# Altium schematic sheet 8KNOBS.SchDoc
size A4; SheetNumber: 3; SheetTotal: 5
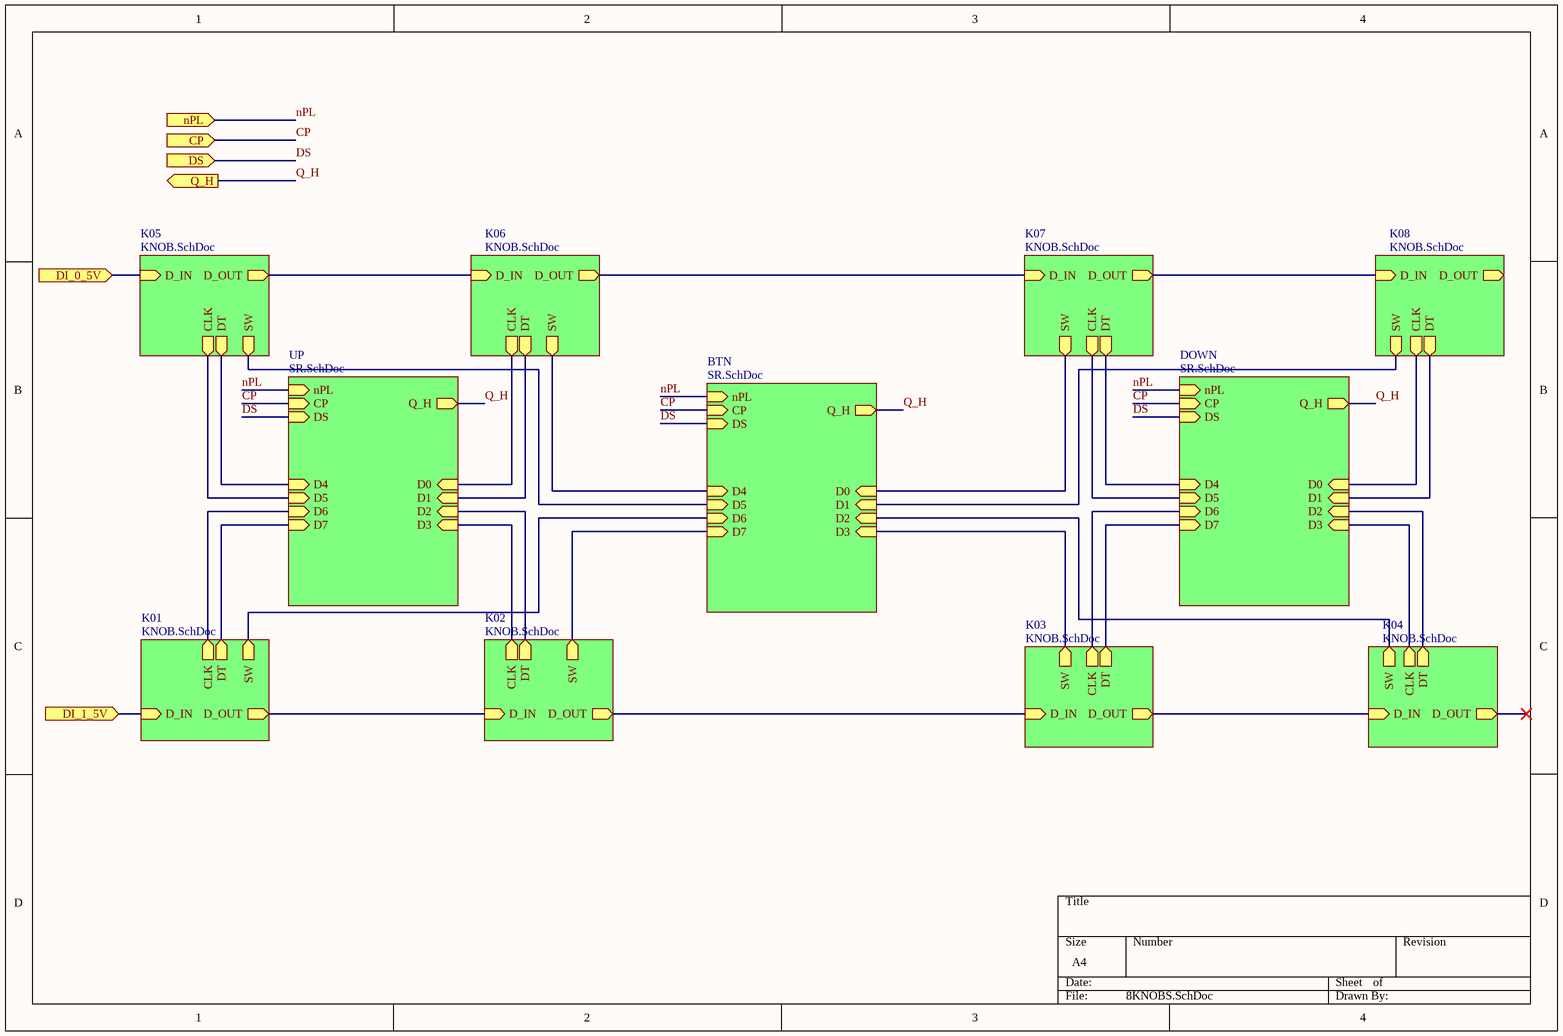
[diagram p0: 8KNOBS.SchDoc]

## Sub-sheets
BTN = SR.SchDoc: nPL (in), CP (in), DS (in), Q_H (out), D4 (in), D5 (in), D6 (in), D7 (in), D0 (in), D1 (in), D2 (in), D3 (in)
DOWN = SR.SchDoc: nPL (in), CP (in), DS (in), Q_H (out), D4 (in), D5 (in), D6 (in), D7 (in), D0 (in), D1 (in), D2 (in), D3 (in)
K01 = KNOB.SchDoc: SW (out), DT (out), CLK (out), D_IN (in), D_OUT (out)
K02 = KNOB.SchDoc: SW (out), DT (out), CLK (out), D_IN (in), D_OUT (out)
K03 = KNOB.SchDoc: SW (out), DT (out), CLK (out), D_IN (in), D_OUT (out)
K04 = KNOB.SchDoc: SW (out), DT (out), CLK (out), D_IN (in), D_OUT (out)
K05 = KNOB.SchDoc: SW (out), DT (out), CLK (out), D_IN (in), D_OUT (out)
K06 = KNOB.SchDoc: SW (out), DT (out), CLK (out), D_IN (in), D_OUT (out)
K07 = KNOB.SchDoc: SW (out), DT (out), CLK (out), D_IN (in), D_OUT (out)
K08 = KNOB.SchDoc: SW (out), DT (out), CLK (out), D_IN (in), D_OUT (out)
UP = SR.SchDoc: nPL (in), CP (in), DS (in), Q_H (out), D4 (in), D5 (in), D6 (in), D7 (in), D0 (in), D1 (in), D2 (in), D3 (in)

## Ports
CP (in), DI_0_5V (in), DI_1_5V (in), DS (in), nPL (in), Q_H (out)

## Nets
CP: port CP, sheet BTN/CP, sheet UP/CP, sheet DOWN/CP
DI_0_5V: port DI_0_5V, sheet K05/D_IN
DI_1_5V: port DI_1_5V, sheet K01/D_IN
DS: port DS, sheet BTN/DS, sheet UP/DS, sheet DOWN/DS
nPL: port nPL, sheet BTN/nPL, sheet UP/nPL, sheet DOWN/nPL
Q_H: port Q_H, sheet BTN/Q_H, sheet UP/Q_H, sheet DOWN/Q_H
(unnamed): sheet K05/SW, sheet BTN/D5
(unnamed): sheet K05/DT, sheet UP/D4
(unnamed): sheet K05/CLK, sheet UP/D5
(unnamed): sheet K05/D_OUT, sheet K06/D_IN
(unnamed): sheet K06/SW, sheet BTN/D4
(unnamed): sheet K06/DT, sheet UP/D1
(unnamed): sheet K06/CLK, sheet UP/D0
(unnamed): sheet K06/D_OUT, sheet K07/D_IN
(unnamed): sheet K01/SW, sheet BTN/D6
(unnamed): sheet K01/DT, sheet UP/D7
(unnamed): sheet K01/CLK, sheet UP/D6
(unnamed): sheet K01/D_OUT, sheet K02/D_IN
(unnamed): sheet K02/SW, sheet BTN/D7
(unnamed): sheet K02/DT, sheet UP/D2
(unnamed): sheet K02/CLK, sheet UP/D3
(unnamed): sheet K02/D_OUT, sheet K03/D_IN
(unnamed): sheet K07/SW, sheet BTN/D0
(unnamed): sheet K07/DT, sheet DOWN/D4
(unnamed): sheet K07/CLK, sheet DOWN/D5
(unnamed): sheet K07/D_OUT, sheet K08/D_IN
(unnamed): sheet K08/SW, sheet BTN/D1
(unnamed): sheet K08/DT, sheet DOWN/D1
(unnamed): sheet K08/CLK, sheet DOWN/D0
(unnamed): sheet K03/SW, sheet BTN/D3
(unnamed): sheet K03/DT, sheet DOWN/D7
(unnamed): sheet K03/CLK, sheet DOWN/D6
(unnamed): sheet K03/D_OUT, sheet K04/D_IN
(unnamed): sheet K04/SW, sheet BTN/D2
(unnamed): sheet K04/DT, sheet DOWN/D2
(unnamed): sheet K04/CLK, sheet DOWN/D3